# Altium schematic sheet STM32F103C8T6.SchDoc
size A3; Author: Van Hieu; Organization: BACH-KHOA-DK; Gmail: maivanhieu24042003@gmail.com
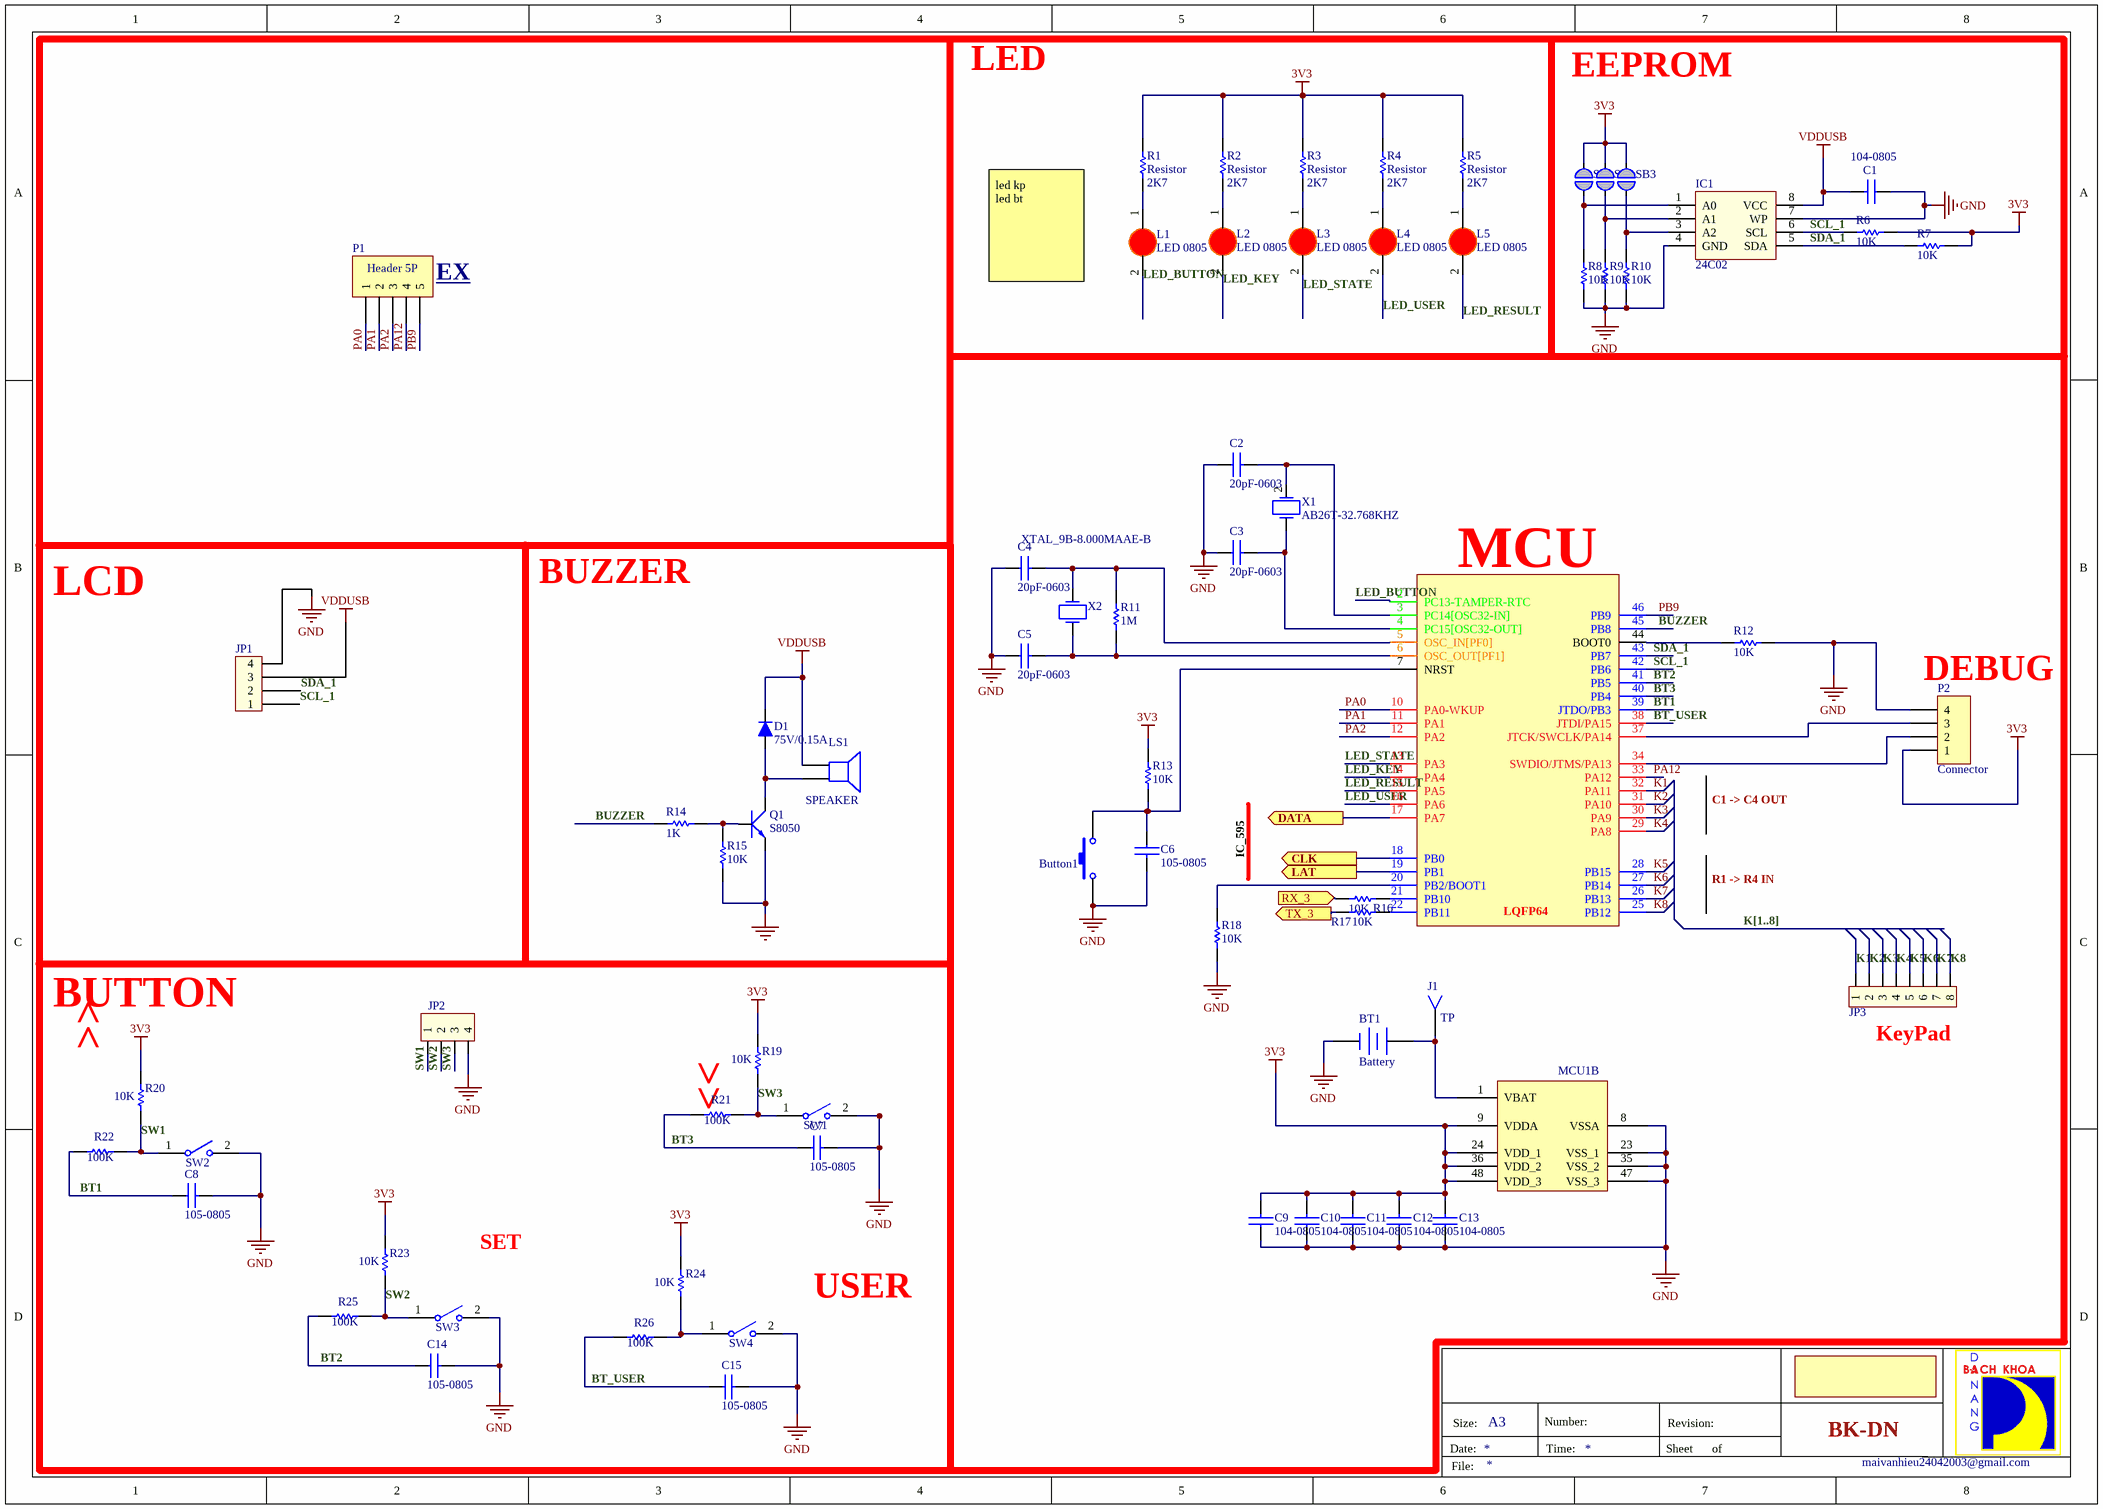
[diagram p0: STM32F103C8T6.SchDoc]

## Parts
BT1  Battery  [CR1220_3V BATTERY HOLDER]
Button1  RS-282G05A3-SM RT  [SW_RS-282G05A3-SM RT]  (value not drawn)
C1  104-0805  [CAP0805]
C2  20pF-0603  [CAP0603]
C3  20pF-0603  [CAP0603]
C4  20pF-0603  [CAP0603]
C5  20pF-0603  [CAP0603]
C6  105-0805  [CAP0805]
C7  105-0805  [CAP0805]
C8  105-0805  [CAP0805]
C9  104-0805  [CAP0805]
C10  104-0805  [CAP0805]
C11  104-0805  [CAP0805]
C12  104-0805  [CAP0805]
C13  104-0805  [CAP0805]
C14  105-0805  [CAP0805]
C15  105-0805  [CAP0805]
D1  75V/0.15A  [DIO-SOD123-1.35H]
IC1  24C02  [DIP8/W0.3]
J1  TP  [TEST_POINT_1.0X1.0MM]
JP1  v  [CON4]  (value not drawn)
JP2  JP4  [CON4]  (value not drawn)
JP3  KeyPad  [JP8]
L1  LED 0805  [LED-RED-0805]
L2  LED 0805  [LED-RED-0805]
L3  LED 0805  [LED-RED-0805]
L4  LED 0805  [LED-RED-0805]
L5  LED 0805  [LED-RED-0805]
LS1  SPEAKER  [SPEAKER]
MCU1  https://www.st.com/resource/en/datasheet/stm32f103c8.pdf  [LQFP48_L]  (value not drawn)  (parts A,B of 2)
P1  Header 5P  [HDR1X5]
P2  Connector  [HDR1X4]
Q1  S8050  [SOT23B]
R1  Resistor  value 2K7  [RESC2012L]
R2  Resistor  value 2K7  [RESC2012L]
R3  Resistor  value 2K7  [RESC2012L]
R4  Resistor  value 2K7  [RESC2012L]
R5  Resistor  value 2K7  [RESC2012L]
R6  value 10K  [RESC2012L]  (hidden comment: Resistor)
R7  value 10K  [RESC2012L]  (hidden comment: Resistor)
R8  value 10K  [RESC2012L]  (hidden comment: Resistor)
R9  value 10K  [RESC2012L]  (hidden comment: Resistor)
R10  value 10K  [RESC2012L]  (hidden comment: Resistor)
R11  value 1M  [RESC2012L]  (hidden comment: Resistor)
R12  value 10K  [RESC2012L]  (hidden comment: Resistor)
R13  value 10K  [RESC2012L]  (hidden comment: Resistor)
R14  value 1K  [RESC2012L]  (hidden comment: Resistor)
R15  value 10K  [RESC2012L]  (hidden comment: Resistor)
R16  value 10K  [RESC2012L]  (hidden comment: Resistor)
R17  value 10K  [RESC2012L]  (hidden comment: Resistor)
R18  value 10K  [RESC2012L]  (hidden comment: Resistor)
R19  value 10K  [RESC2012L]  (hidden comment: Resistor)
R20  value 10K  [RESC2012L]  (hidden comment: Resistor)
R21  value 100K  [RESC2012L]  (hidden comment: Resistor)
R22  value 100K  [RESC2012L]  (hidden comment: Resistor)
R23  value 10K  [RESC2012L]  (hidden comment: Resistor)
R24  value 10K  [RESC2012L]  (hidden comment: Resistor)
R25  value 100K  [RESC2012L]  (hidden comment: Resistor)
R26  value 100K  [RESC2012L]  (hidden comment: Resistor)
SB1  Solderbridge  [Solderbridge]  (value not drawn)  (no BOM)
SB2  Solderbridge  [Solderbridge]  (value not drawn)  (no BOM)
SB3  Solderbridge  [Solderbridge]  (value not drawn)  (no BOM)
SW1  3x4x2.5 2Pin SMD  [Button 3x4mm]  (value not drawn)
SW2  3x4x2.5 2Pin SMD  [Button 3x4mm]  (value not drawn)
SW3  3x4x2.5 2Pin SMD  [Button 3x4mm]  (value not drawn)
SW4  3x4x2.5 2Pin SMD  [Button 3x4mm]  (value not drawn)
X1  AB26T-32.768KHZ  [XTAL_THG_32768Hz]
X2  XTAL_9B-8.000MAAE-B  [XTAL_THG_HC49/US]

## Ports
CLK (out), DATA (out), LAT (out), RX_3 (in), TX_3 (out)

## Nets
3V3: C9.2 C10.2 C11.2 C12.2 C13.2 MCU1.9(VDDA) MCU1.24(VDD_1) MCU1.36(VDD_2) MCU1.48(VDD_3) P2.1 R1.2 R2.2 R3.2 R4.2 R5.2 R6.2 R7.2 R13.2 R19.1 R20.1 R23.1 R24.1 SB1.1 SB2.1 SB3.2
GND: BT1.2(-) Button1.2 C1.1 C2.1 C3.1 C4.1 C5.1 C6.2 C7.2 C8.2 C9.1 C10.1 C11.1 C12.1 C13.1 C14.2 C15.2 IC1.4(GND) IC1.7(WP) JP1.4 JP2.4 MCU1.8(VSSA) MCU1.23(VSS_1) MCU1.35(VSS_2) MCU1.47(VSS_3) P2.4 Q1.3(E) R8.1 R9.1 R10.1 R12.2 R15.2 R18.1 SW1.2(NO1) SW2.2(NO1) SW3.2(NO1) SW4.2(NO1)
VDDUSB: C1.2 D1.2(K) IC1.8(VCC) JP1.3 LS1.1
BT1: C8.1 MCU1.39(JTDO/PB3) R22.2
BT2: C14.1 MCU1.41(PB5) R25.2
BT3: C7.1 MCU1.40(PB4) R21.2
BT_USER: C15.1 MCU1.38(JTDI/PA15) R26.2
BUZZER: MCU1.45(PB8) R14.2
CLK: MCU1.18(PB0) ; port CLK
DATA: MCU1.17(PA7) ; port DATA
K1: JP3.1 MCU1.32(PA11)
K2: JP3.2 MCU1.31(PA10)
K3: JP3.3 MCU1.30(PA9)
K4: JP3.4 MCU1.29(PA8)
K5: JP3.5 MCU1.28(PB15)
K6: JP3.6 MCU1.27(PB14)
K7: JP3.7 MCU1.26(PB13)
K8: JP3.8 MCU1.25(PB12)
LAT: MCU1.19(PB1) ; port LAT
LED_BUTTON: L1.2(K) MCU1.2(PC13-TAMPER-RTC)
LED_KEY: L2.2(K) MCU1.14(PA4)
LED_RESULT: L5.2(K) MCU1.15(PA5)
LED_STATE: L3.2(K) MCU1.13(PA3)
LED_USER: L4.2(K) MCU1.16(PA6)
PA0: MCU1.10(PA0-WKUP) P1.1
PA1: MCU1.11(PA1) P1.2
PA2: MCU1.12(PA2) P1.3
PA12: MCU1.33(PA12) P1.4
PB9: MCU1.46(PB9) P1.5
RX_3: R16.1 ; port RX_3
SCL_1: IC1.6(SCL) JP1.1 MCU1.42(PB6) R6.1
SDA_1: IC1.5(SDA) JP1.2 MCU1.43(PB7) R7.1
SW1: JP2.1 R20.2 R22.1 SW2.1(COMMON1)
SW2: JP2.2 R23.2 R25.1 SW3.1(COMMON1)
SW3: JP2.3 R19.2 R21.1 SW1.1(COMMON1)
TX_3: R17.1 ; port TX_3
NetBT1_1: BT1.1(+) J1.1 MCU1.1(VBAT)
NetButton1_1: Button1.1 C6.1 MCU1.7(NRST) R13.1
NetC2_2: C2.2 MCU1.3(PC14[OSC32-IN]) X1.2(OSC2)
NetC3_2: C3.2 MCU1.4(PC15[OSC32-OUT]) X1.1(OSC1)
NetC4_2: C4.2 MCU1.5(OSC_IN[PF0]) R11.2 X2.2(OSC2)
NetC5_2: C5.2 MCU1.6(OSC_OUT[PF1]) R11.1 X2.1(OSC1)
NetD1_1: D1.1(A) LS1.2 Q1.2(C)
NetIC1_1: IC1.1(A0) R8.2 SB1.2
NetIC1_2: IC1.2(A1) R9.2 SB2.2
NetIC1_3: IC1.3(A2) R10.2 SB3.1
NetL1_1: L1.1(A) R1.1
NetL2_1: L2.1(A) R2.1
NetL3_1: L3.1(A) R3.1
NetL4_1: L4.1(A) R4.1
NetL5_1: L5.1(A) R5.1
NetMCU1_20: MCU1.20(PB2/BOOT1) R18.2
NetMCU1_21: MCU1.21(PB10) R16.2
NetMCU1_22: MCU1.22(PB11) R17.2
NetMCU1_34: MCU1.34(SWDIO/JTMS/PA13) P2.2
NetMCU1_37: MCU1.37(JTCK/SWCLK/PA14) P2.3
NetMCU1_44: MCU1.44(BOOT0) R12.1
NetQ1_1: Q1.1(B) R14.1 R15.1
NetR24_2: R24.2 R26.1 SW4.1(COMMON1)

## Buses and harness runs
bus K[1..8]

## Notes on the sheet
- LED
- EEPROM
- (near P1) EX <dư>
- led kp
  led bt
- BUZZER
- (near MCU1) MCU
- LCD
- (near P2) DEBUG
- IC_595
- C1 -> C4 OUT
- R1 -> R4 IN
- BUTTON
- (near R20) >>
- (near R19) >>
- SET
- (near SW4) USER
- Van Hieu
- Date:
- Size:
- A3
- Number:
- Time:
- Sheet
- Revision:
- of
- BK-DN
- File:
- maivanhieu24042003@gmail.com
- (in symbol STM32F103C8T6, part A) LQFP64

## Library data of the parts
BT1 = Battery: Multicell Battery; Published: 24-Mar-1999; LatestRevisionDate: 17-Jul-2002; LatestRevisionNote: Re-released for DXP Platform.; PackageReference: BAT-2; Publisher: Altium Limited
Button1 = SW_RS-282G05A3-SM RT: SWITCH TACTILE SPST-NO 0.05A 12V; Manufacturer: C&K; Switch Function: Off-Mom; Contact Rating @ Voltage: 0.05A @ 12VDC; Actuator Type: Rectangular Button; Actuator Height off PCB, Vertical: 2.50mm; Actuator Orientation: Top Actuated; Outline: 6.00mm x 3.60mm; Illumination: Non-Illuminated; Operating Force: 250gf; Actuator Material: Polyamide (PA), Nylon; Switch Travel: 0.25mm; Mechanical Life: 50,000 Cycles; Supplier 1: Digi-Key; Manufacturer Part Number: RS-282G05A3-SM RT; RoHS: RoHS Compliant; Category: Switches; Stock 1: 34459; Pricing 1: 1=0.81, 10=0.78, 25=0.7356, 50=0.6474, 100=0.5885, 250=0.55908, 500=0.54436, 1000=0.42666 (USD); Packaging: Digi-Reel®; Part Status: Active; Circuit: SPST-NO; Mounting Type: Surface Mount; Actuator Length, Right Angle: -; Termination Style: Gull Wing; Illumination Type, Color: -; Illumination Voltage (Nominal): -; Ingress Protection: -; Features: -; Operating Temperature: -; ComponentLink1URL: http://media.digikey.com/pdf/Data%20Sheets/C&K/RS-282G05A-SM_RT.pdf; ComponentLink1Description: http://media.digikey.com/pdf/Data%20Sheets/C&K/RS-282G05A-SM_RT.pdf; Supplier Part Number 1: CKN10384DKR-ND
C1 C6-C15 = CC0805JRNPO9BN200: Multilayer Ceramic Capacitors MLCC - SMD/SMT 20pF 50V NPO 5%; Manufacturer: Yageo; Type: General Purpose Surface-Mount Ceramic Multilayer Capacitor; Voltage Rating DC: 50 VDC; Class: Class 1; Dielectric: C0G (NP0); Supplier 1: Mouser; Manufacturer Part Number: CC0805JRNPO9BN200; RoHS: RoHS Compliant By Exemption; Category: Multilayer Ceramic Capacitors MLCC - SMD/SMT; Stock 1: 0; Pricing 1: 1=0.100, 10=0.040, 100=0.018, 1000=0.014, 4000=0.013 (USD); Capacitance: 20 pF; Length: 2 mm; Package / Case: 0805 (2012 metric); Packaging: Cut Tape; Product: General Type MLCCs; Series: CC; Termination Style: SMD/SMT; Tolerance: 5 %; Width: 1.25 mm; Brand: Yageo; Case Code - in: 0805; Case Code - mm: 2012; Maximum Operating Temperature: + 125 C; Minimum Operating Temperature: - 55 C; Product Type: Ceramic Capacitors; Standard Pack Qty: 4000; Subcategory: Capacitors; Termination: Standard; RoHS - Mouser: E; Minimum Order Quantity: 1; Reeling: True; ComponentLink1URL: http://www.mouser.com/datasheet/2/447/UPY-GP_NP0_16V-to-50V_16-1109089.pdf; ComponentLink1Description: http://www.mouser.com/datasheet/2/447/UPY-GP_NP0_16V-to-50V_16-1109089.pdf; Supplier Part Number 1: 603-CC805JRNPO9BN200
C2-C5 = CC0603JRNPO9BN200: CAP CER 20PF 50V C0G/NPO 0603; Manufacturer 1: Yageo; Category 1: Capacitors; Tolerance: ±5%; Temperature Coefficient: C0G, NP0; Supplier 1: Digi-Key; Supplier Part Number 1: 311-1424-1-ND; Manufacturer Part Number 1: CC0603JRNPO9BN200; RoHS 1: RoHS Compliant; Description 1: CAP CER 20PF 50V C0G/NPO 0603; Stock 1: 67895; Pricing 1: 1=0.1, 10=0.037, 100=0.0164, 500=0.01172, 1000=0.0092 (USD); Packaging: Cut Tape (CT); Part Status: Active; Capacitance: 20pF; Voltage - Rated: 50V; Operating Temperature: -55°C ~ 125°C; Features: -; Ratings: -; Applications: General Purpose; Failure Rate: -; Mounting Type: Surface Mount, MLCC; Package / Case: 0603 (1608 Metric); Size / Dimension: 0.063" L x 0.031" W (1.60mm x 0.80mm); Height - Seated (Max): -; Thickness (Max): 0.035" (0.90mm); Lead Spacing: -; Lead Style: -; ComponentLink1URL: http://www.yageo.com/documents/recent/UPY-GP_NP0_16V-to-50V_16.pdf; ComponentLink1Description: http://www.yageo.com/documents/recent/UPY-GP_NP0_16V-to-50V_16.pdf; Value: 20pF
D1 = 1N4148/W/WS: DIO GEN 75V 0.15A SOD323 SMD; MFR PN: 1N4148WS; MFR: ONSEMI; UNIT: PCS; LINK: NA; PRICE: NA
IC1 = 24Cxx: Standard 2-Wire Bus Interface Serial EEPROM; Value: 24Cxx; Value: DIP 8; Copyright by: VanDungEvn
J1 = TEST POINT 1.0X1.0: Manufacturer 1: Bourns Inc.; Manufacturer Part Number 1: PTV09A-4020U-B103; Description 1: POT 10K OHM 1/20W CARBON LINEAR; Category 1: Potentiometers, Variable Resistors; Resistance (Ohms): 10k; Tolerance: ±20%; Built in Switch: None; Power (Watts): 0.05W, 1/20W; Number of Turns: 1; Rotation: 280°; Adjustment Type: Top Adjustment; Resistive Material: Carbon; Actuator Type: Knurled; Actuator Length: 0.787" (20.00mm); Actuator Diameter: 0.236" (6.00mm); Supplier 1: Digi-Key; Supplier Part Number 1: PTV09A-4020U-B103-ND; RoHS 1: RoHS Compliant; Stock 1: 414; Pricing 1: 1=0.83, 10=0.744, 25=0.672, 50=0.648, 100=0.612, 250=0.588, 500=0.552, 1000=0.456, 5000=0.372 (USD); Packaging: Tray; Part Status: Active; Taper: Linear; Temperature Coefficient: -; Termination Style: PC Pins, Board Locks; Bushing Thread: -; Mounting Type: Through Hole, Snap In; ComponentLink1URL: http://www.bourns.com/docs/Product-Datasheets/PTV09.pdf; ComponentLink1Description: http://www.bourns.com/docs/Product-Datasheets/PTV09.pdf
JP1 JP2 = Con4: Connector 4; Value: Connector 4
JP3 = JP8: JP8 PIN; Value: JP7
L1-L5 = LED RED 0805: SMD; Don_Vi: Con; Chung_Loai: Dán; Ma_Hang: MH000897; Ten_Linh_Kien: LED 0805 Màu Đỏ (Red); Ghi_Chu: *; Kieu_Chan: *
MCU1 = STM32F103C8T6: Arm® 32-bit Cortex®-M3 CPU core / – 72 MHz maximum frequency, 1.25 / DMIPS/MHz (Dhrystone 2.1) performance / at 0 wait state memory access / – Single-cycle multiplication and hardware / division
P1 = Header 5x1: Header, 5 Pin Pitch 2.54mm; MPN: S1012EC-40-ND; CompanyID: VT-00125; Solder: WAVE; Value: Header 5P
P2 = Connector_4pin
Q1 = C1815: NPN 600mW, ECB; Value: C1815
R1-R26 = Resistor: Semiconductor Resistor; Published: 8-Jun-2000; LatestRevisionDate: 17-Jul-2002; LatestRevisionNote: Re-released for DXP Platform.; PackageReference: AXIAL-0.5; Publisher: Altium Limited
SB1-SB3 = SOLDERBRIDGE: Artikkelnr Noca: N.A.; Part Number: Solderbridge; Manufacturer: *; Manufacturer Part Number: *; Footprint Doc: Solderbridge; LatestRevisionDate: 2009-12-14; Pin Count: 2; Publisher: Nordic Semiconductor; Published: 2009-12-14; Value: Solderbridge; Note: *; Supplier: *; Supplier part number: *; 2nd source Supplier: *; 2nd source part number: *; Artikkelnr Simpro: N.A.; ComponentLink1Description: Datasheet; ComponentLink1URL: *; ComponentLink2Description: Supplier link; ComponentLink2URL: *; HelpURL: *
SW1-SW4 = BUTTON 2-SMD RS-282G05A3: Manufacturer: C&K Components; Manufacturer Part Number: RS-282G05A3-SM RT; Circuit: SPST-NO; Switch Function: Off-Mom; Contact Rating @ Voltage: 0.05A @ 12VDC; Actuator Type: Rectangular Button; Actuator Height off PCB, from Pins: 2.50mm; Actuator Orientation: Top Actuated; Outline: 6.00mm x 3.60mm; Illumination: Non-Illuminated; Operating Force: 250gf; Actuator Material: Polyamide (PA), Nylon; Switch Travel: 0.25mm; Mechanical Life: 50,000 Cycles; RoHS: RoHS Compliant; Category: Switches; Packaging: Cut Tape (CT); Part Status: Active; Mounting Type: Surface Mount; Termination Style: Gull Wing; Illumination Voltage (Nominal): -; Illumination Type, Color: -; Ingress Protection: -; Features: -; Operating Temperature: -; ComponentLink1URL: http://media.digikey.com/pdf/Data%20Sheets/C&K/RS-282G05A-SM_RT.pdf; ComponentLink1Description: http://media.digikey.com/pdf/Data%20Sheets/C&K/RS-282G05A-SM_RT.pdf; Supplier 1: Digi-Key; Supplier Part Number 1: CKN10384CT-ND; Buy Link: https://thegioiic.com/products/nut-nhan-3x4x2-5-2pin-smd
X1 = XTAL_AB26T-32.768KHZ: CRYSTAL 32.7680KHZ 12.5PF T/H; Manufacturer: Abracon LLC; Frequency Tolerance: ±20ppm; Operating Mode: Fundamental; Supplier 1: Digi-Key; Manufacturer Part Number: AB26T-32.768KHZ; RoHS: RoHS Compliant; Category: Crystals, Oscillators, Resonators; Stock 1: 17810; Pricing 1: 1=0.21, 10=0.175, 50=0.1576, 100=0.14, 500=0.133, 1000=0.112, 2500=0.105, 5000=0.1015, 10000=0.098 (USD); Packaging: Bulk; Part Status: Active; Type: kHz Crystal (Tuning Fork); Frequency Stability: -; Load Capacitance: 12.5pF; Operating Temperature: -10°C ~ 60°C; Ratings: -; Mounting Type: Through Hole; Package / Case: Cylindrical Can, Radial; Size / Dimension: 0.083" Dia x 0.244" L (2.10mm x 6.20mm); Height - Seated (Max): 0.244" (6.20mm); ComponentLink1URL: http://www.abracon.com/Resonators/AB26T.pdf; ComponentLink1Description: http://www.abracon.com/Resonators/AB26T.pdf; Supplier Part Number 1: 535-9032-ND
X2 = XTAL_9B-8.000MAAE-B: CRYSTAL 8.0000MHZ 12PF T/H; Manufacturer: TXC CORPORATION; Frequency Stability: ±30ppm; Operating Mode: Fundamental; Supplier 1: Digi-Key; Manufacturer Part Number: 9B-8.000MAAE-B; RoHS: RoHS Compliant; Category: Crystals, Oscillators, Resonators; Stock 1: 0; Pricing 1: 1000=0.192 (USD); Packaging: Bulk; Part Status: Active; Type: MHz Crystal; Frequency Tolerance: ±30ppm; Load Capacitance: 12pF; Operating Temperature: -20°C ~ 70°C; Ratings: -; Mounting Type: Through Hole; Package / Case: HC49/US; Size / Dimension: 0.453" L x 0.197" W (11.50mm x 5.00mm); Height - Seated (Max): 0.145" (3.68mm); ComponentLink1URL: http://www.txccorp.com/download/products/quartz_crystals/2015TXC_9B_33.pdf; ComponentLink1Description: http://www.txccorp.com/download/products/quartz_crystals/2015TXC_9B_33.pdf; Supplier Part Number 1: 9B-8.000MAAE-B-ND